# EAGLE design USB Host (EAGLE 6.5.0)
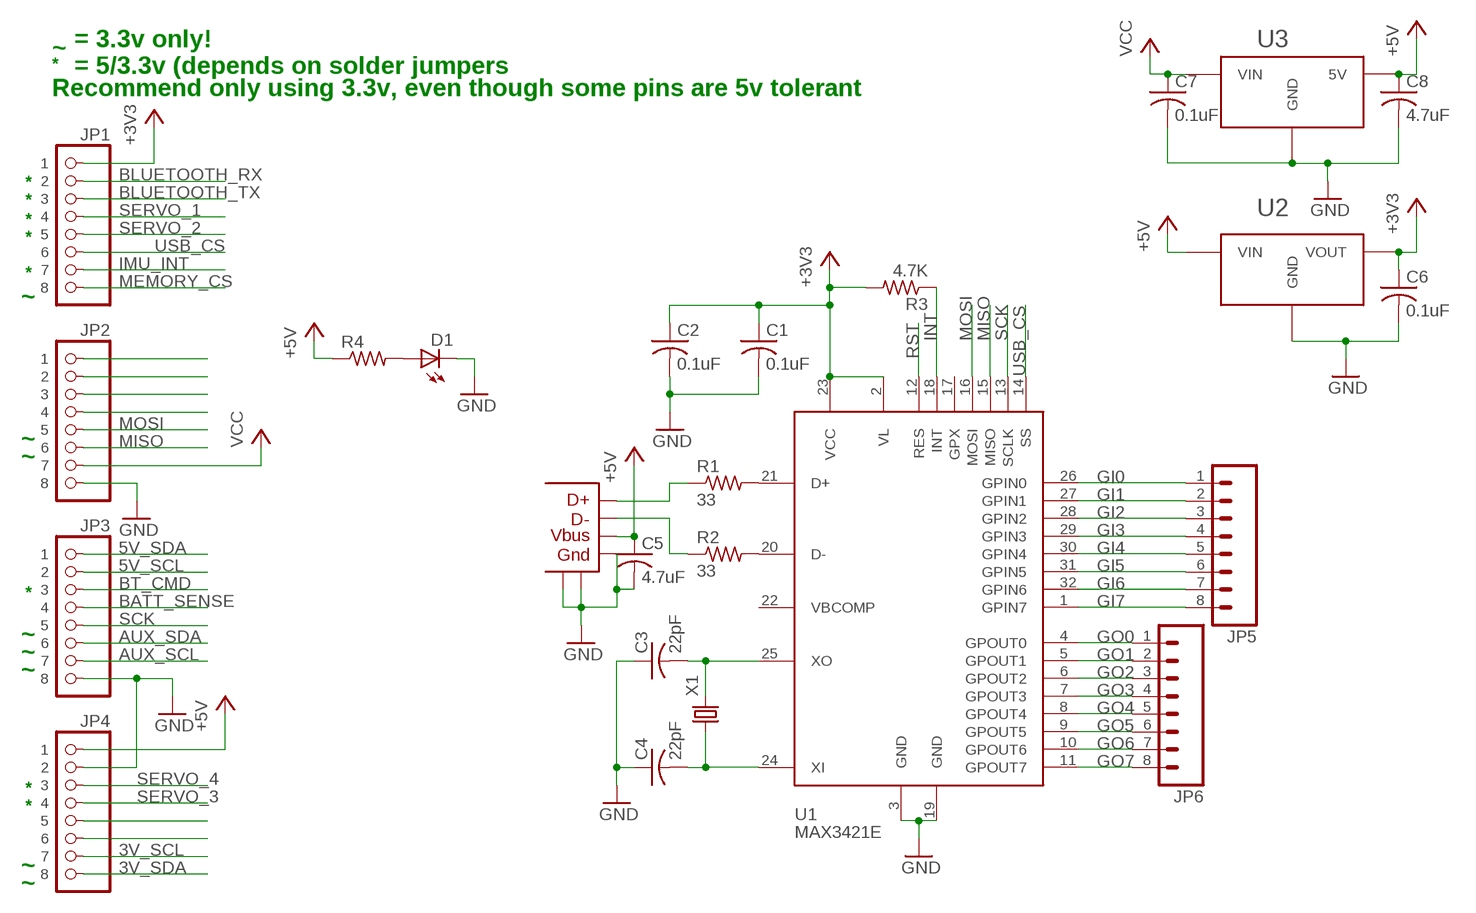
[diagram p0: schematic, sheet 1]

## Parts
C1  0.1uF  C-USC0603  [C0603]
C2  0.1uF  C-USC0603  [C0603]
C3  22pF  C-USC0603  [C0603]
C4  22pF  C-USC0603  [C0603]
C5  4.7uF  C-USC0603  [C0603]
C6  0.1uF  C-USC0603  [C0603]
C7  0.1uF  C-USC0603  [C0603]
C8  4.7uF  C-USC0603  [C0603]
D1  LED-GREENLED-0805_NO_SILK  [LED-0805]
JP1  8-PIN_HEADER  [8-PIN_RECEPTACLE_LOCK_NO-SS]
JP2  8-PIN_HEADER  [8-PIN_RECEPTACLE_LOCK_NO-SS]
JP3  8-PIN_HEADER  [8-PIN_RECEPTACLE_LOCK_NO-SS]
JP4  8-PIN_HEADER  [8-PIN_RECEPTACLE_LOCK_NO-SS]
JP5  M081X08  [1X08]
JP6  M081X08  [1X08]
R1  33  R-US_R0603  [R0603]
R2  33  R-US_R0603  [R0603]
R3  4.7K  R-US_R0603  [R0603]
R4  R-US_R0603  [R0603]
U1  MAX3421E  [TQFP32_8MIL]
U2  AP7313SOT23R  [SOT23]
U3  LM2931  [TO263]
U$1  USB_SOCKETTYPE-A  [USB_SOCKET]
X1  CRYSTALTXC-7A  [CRYSTAL-TXC-7A]

## Nets
3V_SCL: JP4.P$7
3V_SDA: JP4.P$8
5V_SCL: JP3.P$2
5V_SDA: JP3.P$1
+3V3: C1.1 C2.1 C6.1 JP1.P$1 R3.2 U1.2(VL) U1.23(VCC) U2.P$2(VOUT)
+5V: C5.1 C8.1 JP4.P$1 R4.1 U2.P$3(VIN) U3.P$3(5V) U$1.P$1(VBUS)
AUX_SCL: JP3.P$7
AUX_SDA: JP3.P$6
BATT_SENSE: JP3.P$4
BLUETOOTH_RX: JP1.P$2
BLUETOOTH_TX: JP1.P$3
BT_CMD: JP3.P$3
GI0: JP5.1 U1.26(GPIN0)
GI1: JP5.2 U1.27(GPIN1)
GI2: JP5.3 U1.28(GPIN2)
GI3: JP5.4 U1.29(GPIN3)
GI4: JP5.5 U1.30(GPIN4)
GI5: JP5.6 U1.31(GPIN5)
GI6: JP5.7 U1.32(GPIN6)
GI7: JP5.8 U1.1(GPIN7)
GND: C1.2 C2.2 C3.1 C4.1 C5.2 C6.2 C7.2 C8.2 D1.2(C) JP2.P$8 JP3.P$8 JP4.P$2 U1.3(GND) U1.19(GND) U2.P$1(GND) U3.P$1(GND) U$1.P$4(GND) U$1.P$5 U$1.P$6
GO0: JP6.1 U1.4(GPOUT0)
GO1: JP6.2 U1.5(GPOUT1)
GO2: JP6.3 U1.6(GPOUT2)
GO3: JP6.4 U1.7(GPOUT3)
GO4: JP6.5 U1.8(GPOUT4)
GO5: JP6.6 U1.9(GPOUT5)
GO6: JP6.7 U1.10(GPOUT6)
GO7: JP6.8 U1.11(GPOUT7)
IMU_INT: JP1.P$7
INT: R3.1 U1.18(INT)
MEMORY_CS: JP1.P$8
MISO: JP2.P$6 U1.15(MISO)
MOSI: JP2.P$5 U1.16(MOSI)
N$1: R2.2 U1.20(D-)
N$2: R1.2 U1.21(D+)
N$3: R2.1 U$1.P$2(D-)
N$4: JP2.P$4
N$5: JP2.P$3
N$6: JP2.P$2
N$7: JP2.P$1
N$8: R1.1 U$1.P$3(D+)
N$9: D1.1(A) R4.2
N$11: C4.2 U1.24(XI) X1.P$1
N$12: C3.2 U1.25(XO) X1.P$2
N$26: JP4.P$5
N$27: JP4.P$6
RST: U1.12(RES)
SCK: JP3.P$5 U1.13(SCLK)
SERVO_1: JP1.P$4
SERVO_2: JP1.P$5
SERVO_3: JP4.P$4
SERVO_4: JP4.P$3
USB_CS: JP1.P$6 U1.14(SS)
VCC: C7.1 JP2.P$7 U3.P$2(VIN)
Unconnected: U1.17(GPX) U1.22(VBCOMP)

## Notes on the sheet
- = 3.3v only!
- ~
- * | = 5/3.3v (depends on solder jumpers
- Recommend only using 3.3v, even though some pins are 5v tolerant
- *
- *
- *
- *
- *
- ~
- ~
- ~
- *
- ~
- ~
- ~
- *
- *
- ~
- ~

## Library data of the parts
C1-C8 = resistor:C-US: CAPACITOR, American symbol
D1 = SparkFun-LED:LED-GREEN: Various green LEDs 0603- DIO-00821 LARGE- DIO-00862 LILYPAD- DIO-09910
JP1-JP4 = My Parts:8-PIN_HEADER
JP5 JP6 = SparkFun-Connectors:M08: Header 8 Standard 8-pin 0.1" header. Use with straight break away headers (SKU : PRT-00116), right angle break away headers (PRT-00553), swiss pins (PRT-00743), machine pins (PRT-00117), and female headers (PRT-00115).
R1-R4 = resistor:R-US_: RESISTOR, American symbol
U1 = CH_Maxim:MAX3421E
U2 = My Parts:AP7313: 3.3v LDO Voltage Regulator
U3 = on-semiconductor:LM2931
U$1 = My Parts:USB_SOCKET; PART#: USB-A1HSW6
X1 = SparkFun-FreqCtrl:CRYSTAL: Various standard crystals. Proven footprints. Spark Fun Electronics SKU : COM-00534; PART#: 7A-12.000MAAE-T

## Board
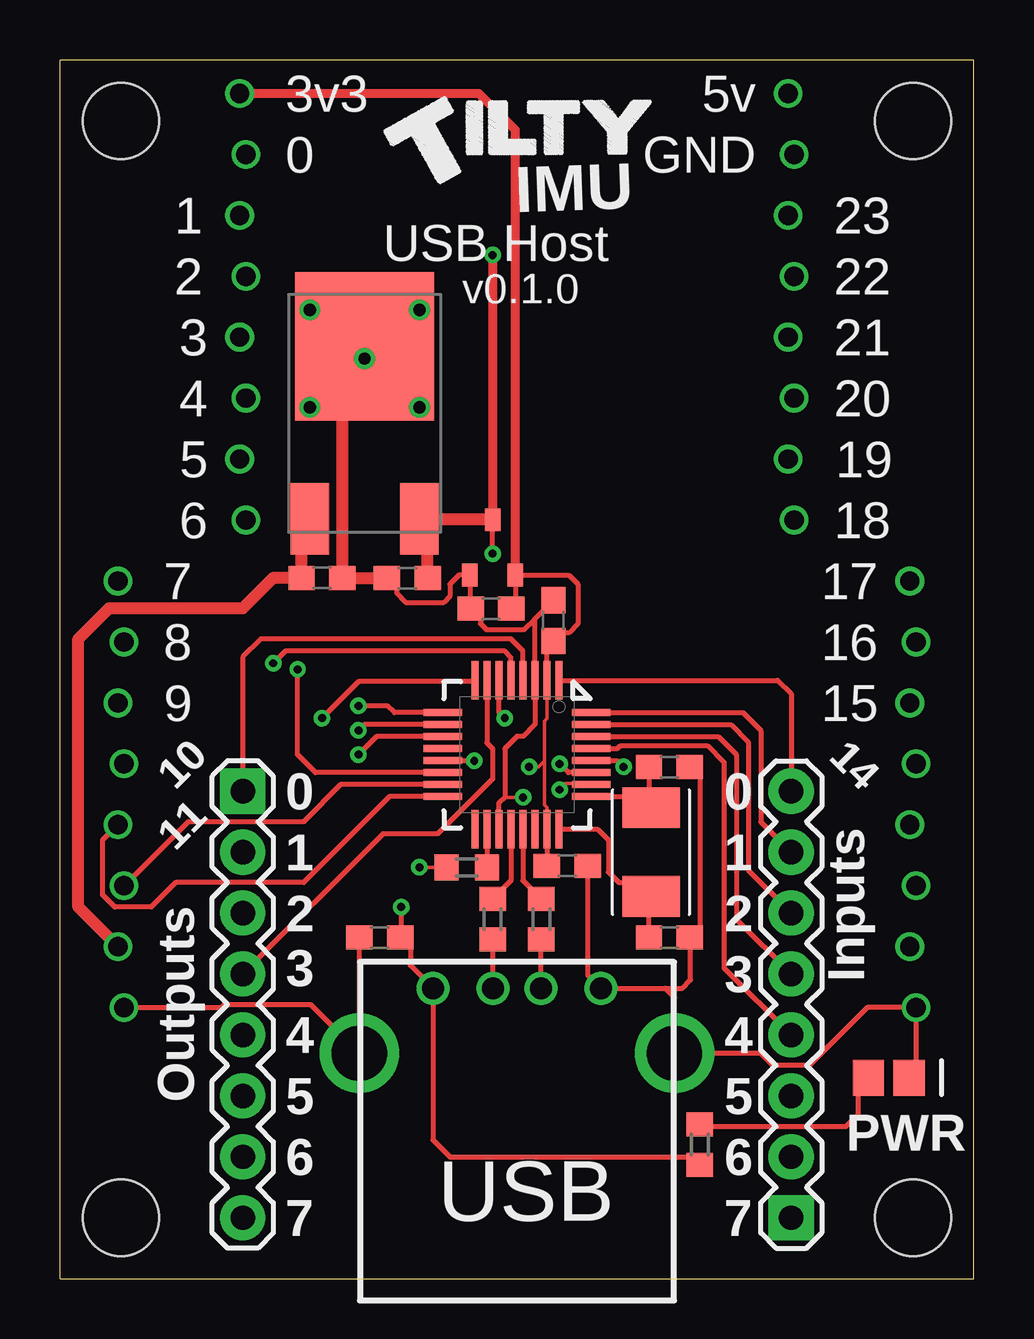
[diagram p1: board, top side]
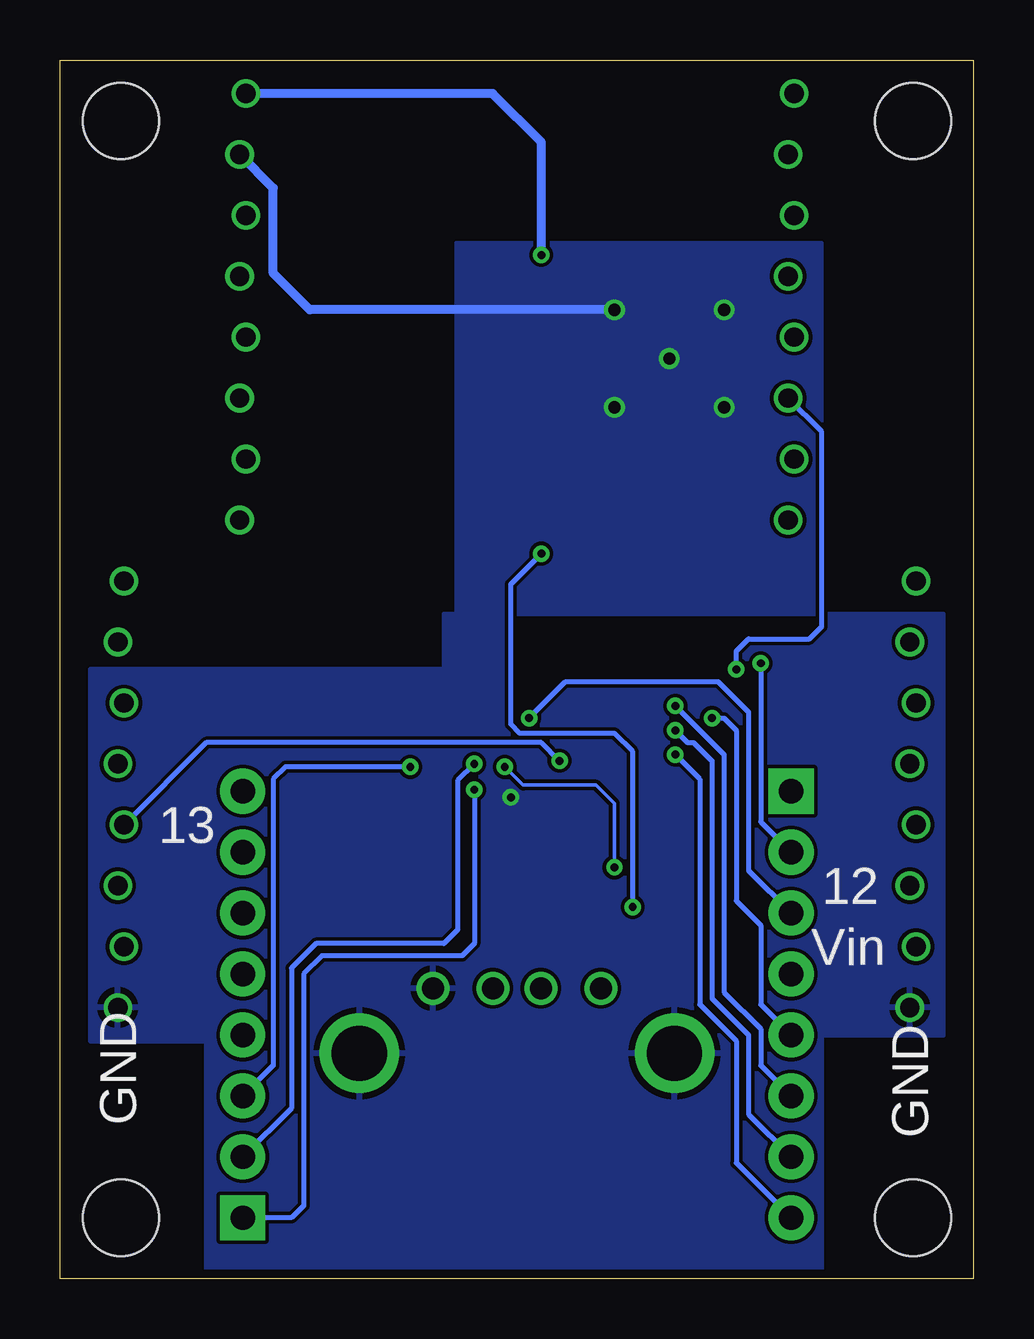
[diagram p2: board, bottom side, seen from below]

Size 38.1 x 50.8 mm. Coordinates in mm from the lower left corner, seen from the top.
Outline: 0,0 38.1,0 38.1,50.8 0,50.8 0,0
Copper layers (1*16): Top 0.0356mm / dielectric 1.5011mm / Bottom 0.0356mm
Design rules "LaenPCBOrder": minimum track width 6mil, minimum drill 13mil, track to track 6mil, track to pad 6mil, pad to pad 6mil, via to via 6mil, smd to smd 6mil, copper to edge 15mil, drill to drill 6mil, minimum pad ring 7mil, minimum via ring 7mil, stop-mask expansion 4mil, vias tented up to drill 0mil, thermal gap 10mil
Holes 3.17 mm at 35.56,48.26 35.56,2.54 2.54,2.54 2.54,48.26

### Footprints (pad centres in the part's own frame; a part is rotated, then mirrored left to right if it is on the bottom)
C0603 = smd 1.1 x 1: 1 -0.85,0; 2 0.85,0
LED-0805 = smd 1.3 x 1.5: 1 -0.85,0; 2 0.85,0
8-PIN_RECEPTACLE_LOCK_NO-SS = drill 0.8: P$1 -8.89,-0.127; P$2 -6.35,0.127; P$3 -3.81,-0.127; P$4 -1.27,0.127; P$5 1.27,-0.127; P$6 3.81,0.127; P$7 6.35,-0.127; P$8 8.89,0.127
1X08 = drill 1.016 pad 1.88 square: 1 0,0 | drill 1.016 pad 1.88: 2 2.54,0; 3 5.08,0; 4 7.62,0; 5 10.16,0; 6 12.7,0; 7 15.24,0; 8 17.78,0
R0603 = smd 1 x 1.1: 1 -0.85,0; 2 0.85,0
TQFP32_8MIL = smd 0.294 x 1.6: 1 -1.75,-3.1; 2 -1.25,-3.1; 3 -0.75,-3.1; 4 -0.25,-3.1; 5 0.25,-3.1; 6 0.75,-3.1; 7 1.25,-3.1; 8 1.75,-3.1; 17 1.75,3.1; 18 1.25,3.1; 19 0.75,3.1; 20 0.25,3.1; 21 -0.25,3.1; 22 -0.75,3.1; 23 -1.25,3.1; 24 -1.75,3.1 | smd 1.6 x 0.294: 9 3.1,-1.75; 10 3.1,-1.25; 11 3.1,-0.75; 12 3.1,-0.25; 13 3.1,0.25; 14 3.1,0.75; 15 3.1,1.25; 16 3.1,1.75; 25 -3.1,1.75; 26 -3.1,1.25; 27 -3.1,0.75; 28 -3.1,0.25; 29 -3.1,-0.25; 30 -3.1,-0.75; 31 -3.1,-1.25; 32 -3.1,-1.75
SOT23 = smd 0.65 x 0.95: P$1 -0.95,-1.15; P$2 0.95,-1.15; P$3 0,1.15
TO263 = smd 5.791 x 6.198: P$1 0,2.794 | smd 1.6 x 2.997: P$2 -2.286,-4.394; P$3 2.286,-4.394
USB_SOCKET = drill 0.92: P$1 -3.5,2.71; P$2 -1,2.71; P$3 1,2.71; P$4 3.5,2.71 | drill 2.3: P$5 -6.57,0; P$6 6.57,0
CRYSTAL-TXC-7A = smd 1.7 x 2.4: P$1 1.85,0; P$2 -1.85,0

### Placement (x,y rotation side)
C1  20.57,27.43 90 top
C2  21.15,17.21 0 top
C3  25.4,21.34 180 top
C4  25.4,14.22 180 top
C5  13.34,14.22 180 top
C6  17.97,27.94 180 top
C7  10.92,29.21 0 top
C8  14.48,29.21 180 top
D1  34.54,8.38 0 top
JP1  7.62,40.51 270 top
JP2  2.54,20.19 270 top
JP3  35.56,20.19 270 top
JP4  30.48,40.51 270 top
JP5  30.48,2.54 90 top
JP6  7.62,20.32 270 top
R1  20.07,14.99 90 top
R2  18.03,14.99 90 top
R3  16.95,17.14 180 top
R4  26.67,5.59 90 top
U1  19.05,21.84 180 top
U2  18.03,30.48 0 top
U3  12.7,36.07 0 top
U$1  19.05,9.4 0 top
X1  24.64,17.78 270 top

### Tracks (layer width: path | path; a pad name or v marks a point on that pad's centre or on a via)
+3V3  (via drill 0.33)
  Top 0.152: U1.23 20.3,19.64 20.19,19.75 20.19,21.59 | 20.19,21.59 20.19,23.24 20.3,23.35 U1.2 | v19.56,21.34 19.94,21.34 20.19,21.59 | v14.99,17.14 R3.2
  Top 0.203: U1.2 20.3,26.31 C1.1 20.92,26.92 21.21,26.92 21.59,27.3 21.59,28.96 21.22,29.33 U2.P$2 18.98,28.1 C6.1 | U1.23 C2.1
  Top 0.381: U2.P$2 18.98,47.88 17.46,49.4 JP1.P$1
  Bottom 0.152: v14.99,17.14 14.99,19.81 15.75,20.57 18.8,20.57 v19.56,21.34
+5V  (via drill 0.33)
  Top 0.203: v14.22,15.49 14.22,14.26 C5.1 14.22,14.22 14.61,13.84 14.61,13.05 U$1.P$1 15.55,5.79 16.26,5.08 26.33,5.08 R4.1 | v18.03,30.23 U2.P$3
  Top 0.381: v18.03,42.67 U2.P$3
  Top 0.508: C8.1 15.33,31.33 U3.P$3 17.99,31.67 U2.P$3
  Bottom 0.203: v14.22,15.49 14.22,21.97 14.99,22.73 18.92,22.73 19.3,23.11 19.3,28.96 v18.03,30.23
  Bottom 0.381: v18.03,42.67 18.03,47.37 20.07,49.4 JP4.P$1
GI0  (via drill 0.33)
  Top 0.152: v20.83,20.38 21.08,20.64 22.11,20.64 U1.26
  Bottom 0.203: v20.83,20.38 20.83,13.97 21.34,13.46 27.18,13.46 27.94,12.7 27.94,3.05 28.45,2.54 JP5.1
GI1  (via drill 0.33)
  Top 0.203: U1.27 21.2,21.09 v20.83,21.46
  Bottom 0.203: v20.83,21.46 21.53,20.77 21.53,14.54 22.1,13.97 27.43,13.97 28.45,12.95 28.45,7.11 JP5.2
GI2  (via drill 0.33)
  Top 0.203: U1.28 23.24,21.59 v23.5,21.34
  Bottom 0.203: v23.5,21.34 28.7,21.34 29.21,20.83 29.21,8.89 JP5.3
GI3
  Top 0.203: U1.29 23.24,22.09 23.37,22.23 26.99,22.23 27.69,21.53 27.69,12.95 JP5.4
GI4
  Top 0.203: U1.30 27.44,22.59 28.19,21.84 28.19,14.99 JP5.5
GI5
  Top 0.203: U1.31 27.96,23.09 28.7,22.35 28.7,17.02 JP5.6
GI6
  Top 0.203: 22.18,23.62 U1.32 28.48,23.59 29.21,22.86 29.21,19.05 JP5.7
GI7
  Top 0.203: U1.1 29.92,24.94 30.48,24.38 JP5.8
GND  (via drill 0.33, 0.51)
  Top 0.152: 18.54,20.07 v19.3,20.07
  Top 0.203: 19.8,27.51 U1.3 19.81,24.93 19.81,23.11 19.3,22.61 19.05,22.61 18.54,22.1 18.54,20.07 18.3,19.82 U1.19 | 19.8,27.51 C1.2 | C5.2 U$1.P$5 10.45,11.43 6.86,11.43 6.73,11.3 JP2.P$8 | C2.2 22,12.66 U$1.P$4 25.23,12.11 | C3.1 26.42,21.34 26.67,21.08 26.67,14.64 C4.1 26.29,14.19 26.29,12.45 25.95,12.11 25.23,12.11 | 25.23,12.11 25.62,11.72 U$1.P$6 29.21,9.4 29.72,8.89 31.24,8.89 33.66,11.3 JP3.P$8 35.69,8.68 D1.2 | 19.8,27.51 19.34,27.05 17.78,27.05 17.53,27.3 17.53,27.69 17.27,27.94 C6.2 17.08,27.98 U2.P$1 16.63,29.33 16.26,28.96 16.26,28.45 16,28.19 14.41,28.19 14.03,28.57 14.03,28.83 13.65,29.21 C8.2
  Top 0.381: v10.41,36.32 10.67,36.32 v12.7,38.35 | v10.41,40.39 10.67,40.39 v12.7,38.35 | v14.99,40.39 14.73,40.39 v12.7,38.35 | v12.7,38.35 12.95,38.35 v14.99,36.32 | v12.7,38.35 U3.P$1
  Top 0.508: C8.2 C7.2 11.77,37.93 U3.P$1
  Bottom 0.381: v14.99,40.39 27.69,40.39 29.21,41.91 29.21,45.47 JP4.P$2
  pour Bottom: 1.27,27.69 22.1,27.69 22.1,25.4 36.83,25.4 36.83,9.91 32,9.91 32,0 6.35,0 6.35,10.16 1.27,10.16
  pour Bottom: 6.35,30.23 6.35,43.18 21.59,43.18 21.59,27.69 6.35,27.69
GO0
  Top 0.203: U1.4 19.3,26.17 18.8,26.67 8.38,26.67 7.62,25.91 JP6.1
GO1  (via drill 0.33)
  Top 0.203: U1.5 18.8,25.9 18.54,26.16 9.4,26.16 v8.89,25.65
  Bottom 0.203: v8.89,25.65 8.89,19.05 JP6.2
GO2  (via drill 0.33)
  Top 0.203: U1.6 18.29,24.93 18.29,23.62 v18.54,23.37
  Bottom 0.203: JP6.3 9.4,17.02 9.4,23.62 10.67,24.89 17.02,24.89 v18.54,23.37
GO3
  Top 0.203: U1.7 17.8,22.33 18.03,22.1 18.03,20.83 15.75,18.54 13.46,18.54 JP6.4
GO4  (via drill 0.33)
  Top 0.203: U1.8 17.25,24.89 12.45,24.89 v10.92,23.37
  Bottom 0.203: v10.92,23.37 10.41,23.37 9.91,22.86 9.91,15.75 8.89,14.73 8.89,11.43 JP6.5
GO5  (via drill 0.33)
  Top 0.203: U1.9 13.94,23.59 13.65,23.88 v12.45,23.88
  Bottom 0.203: v12.45,23.88 10.41,21.84 10.41,11.94 8.89,10.41 8.89,8.89 JP6.6
GO6  (via drill 0.33)
  Top 0.203: U1.10 12.68,23.09 v12.45,22.86
  Bottom 0.203: JP6.7 9.4,6.86 9.4,10.16 10.92,11.68 10.92,21.59 11.68,22.35 11.94,22.35 v12.45,22.86
GO7  (via drill 0.33)
  Top 0.203: U1.11 13.2,22.59 v12.45,21.84
  Bottom 0.203: JP6.8 9.91,4.83 9.91,9.91 11.43,11.43 11.43,20.83 v12.45,21.84
INT
  Top 0.203: U1.18 R3.1
MISO
  Top 0.203: U1.15 11.7,20.59 10.16,19.05 5.33,19.05 JP2.P$6
MOSI
  Top 0.203: U1.16 13.74,20.09 10.16,16.51 4.83,16.51 3.81,15.49 2.29,15.49 1.78,16 1.78,18.29 JP2.P$5
N$1
  Top 0.203: U1.20 18.8,16.6 R2.2
N$2
  Top 0.203: U1.21 19.3,16.6 R1.2
N$3
  Top 0.203: U$1.P$2 18.05,14.12 R2.1
N$8
  Top 0.203: U$1.P$3 20.05,14.12 R1.1
N$9
  Top 0.203: R4.2 26.84,6.44 26.92,6.35 32.77,6.35 33.27,6.86 33.27,7.96 D1.1
N$11
  Top 0.203: C4.2 24.55,15.84 X1.P$1 24.06,16.51 23.3,16.51 22.86,16.95 22.86,18.29 22.4,18.74 U1.24
N$12
  Top 0.203: C3.2 24.55,19.72 X1.P$2 24.17,20.09 U1.25
SCK  (via drill 0.33)
  Top 0.203: v17.27,21.59 U1.13
  Bottom 0.203: v17.27,21.59 18.03,22.35 32,22.35 JP3.P$5
USB_CS  (via drill 0.33)
  Top 0.203: U1.14 10.66,21.09 9.91,21.84 v9.91,25.4
  Bottom 0.203: v9.91,25.4 9.91,26.16 9.4,26.67 6.86,26.67 6.35,27.18 6.35,35.31 JP1.P$6
VCC
  Top 0.508: JP2.P$7 0.76,15.49 0.76,26.67 2.03,27.94 7.62,27.94 8.89,29.21 C7.1 10.07,31.33 U3.P$2

### Text on the board
tNames: 3v3 | 5v | 0 | GND | 1 | IMU | 23 | USB Host | 2 | v0.1.0 | 22 | 3 | 21 | 4 | 20 | 5 | 19 | 6 | 18 | 7 | 17 | 8 | 16 | 9 | 15 | 10 | 0 | 0 | 14 | Inputs | 11 | 1 | 1 | 2 | 2 | 3 | 3 | 4 | 4 | Outputs | 5 | 5 | PWR | 6 | 6 | 7 | 7
bNames: 13 | 12 | Vin | GND | GND